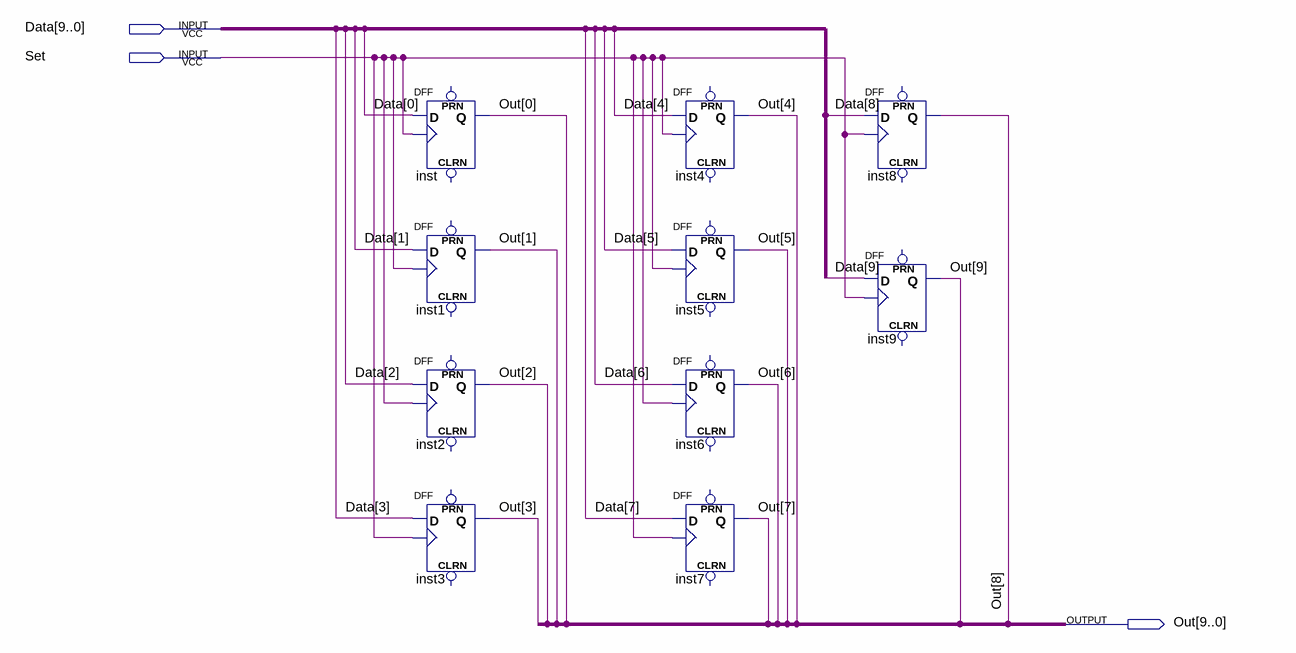
[diagram p0: schematic sheet]
// Quartus schematic reg.bdf as structural Verilog: 10 symbols, 3 pins
module \reg  (
  input  [9:0] Data,
  input  Set,
  output [9:0] Out
);

  DFF inst (.CLK(Set), .D(Data[0]), .Q(Out[0]));  // open: CLRN, PRN
  DFF inst1 (.CLK(Set), .D(Data[1]), .Q(Out[1]));  // open: CLRN, PRN
  DFF inst2 (.CLK(Set), .D(Data[2]), .Q(Out[2]));  // open: CLRN, PRN
  DFF inst3 (.CLK(Set), .D(Data[3]), .Q(Out[3]));  // open: CLRN, PRN
  DFF inst4 (.CLK(Set), .D(Data[4]), .Q(Out[4]));  // open: CLRN, PRN
  DFF inst5 (.CLK(Set), .D(Data[5]), .Q(Out[5]));  // open: CLRN, PRN
  DFF inst6 (.CLK(Set), .D(Data[6]), .Q(Out[6]));  // open: CLRN, PRN
  DFF inst7 (.CLK(Set), .D(Data[7]), .Q(Out[7]));  // open: CLRN, PRN
  DFF inst8 (.CLK(Set), .D(Data[8]), .Q(Out[8]));  // open: CLRN, PRN
  DFF inst9 (.CLK(Set), .D(Data[9]), .Q(Out[9]));  // open: CLRN, PRN
endmodule
